# EAGLE design googleShoes_rev01 (EAGLE 6.2)
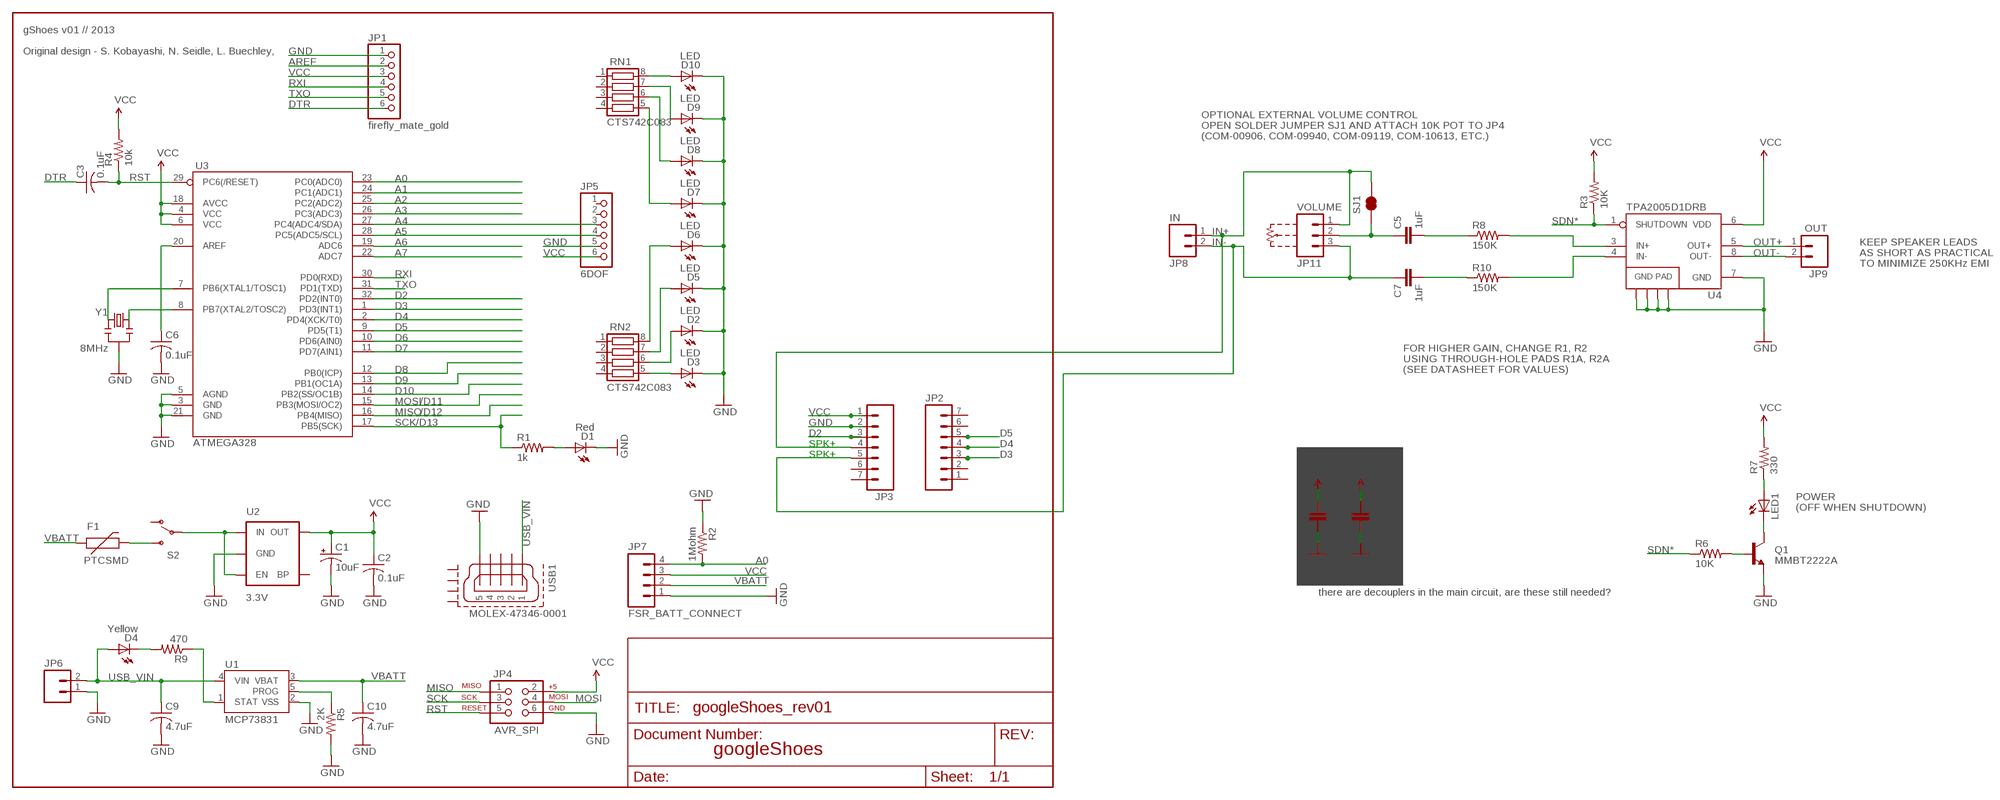
[diagram p0: schematic, sheet 1]

## Parts
C1  10uF  CAP_POL1206  [EIA3216]
C2  0.1uF  C-USC0805  [C0805]
C3  0.1uF  C-USC0805  [C0805]
C4  1uF  CAP1206  [1206]
C5  1uF  CAP1206  [1206]
C6  0.1uF  C-USC0805  [C0805]
C7  1uF  CAP1206  [1206]
C8  10uF  CAP1206  [1206]
C9  4.7uF  C-USC0805  [C0805]
C10  4.7uF  C-USC0805  [C0805]
D1  Red  LEDCHIP-LED0805  [CHIP-LED0805]
D2  LED  LEDCHIP-LED0805  [CHIP-LED0805]
D3  LED  LEDCHIP-LED0805  [CHIP-LED0805]
D4  Yellow  LEDCHIP-LED0805  [CHIP-LED0805]
D5  LED  LEDCHIP-LED0805  [CHIP-LED0805]
D6  LED  LEDCHIP-LED0805  [CHIP-LED0805]
D7  LED  LEDCHIP-LED0805  [CHIP-LED0805]
D8  LED  LEDCHIP-LED0805  [CHIP-LED0805]
D9  LED  LEDCHIP-LED0805  [CHIP-LED0805]
D10  LED  LEDCHIP-LED0805  [CHIP-LED0805]
F1  PTCSMD  [PTC-1206]
JP1  firefly_mate_gold  PINHD-1X6B  [1X06-BIG]
JP2  M07  [1X07]
JP3  M07  [1X07]
JP4  AVR_SPI  AVR_SPI_PRG_6PTH  [2X3]
JP5  6DOF  PINHD-1X6B  [1X06-BIG]
JP6  M02PTH  [1X02]
JP7  FSR_BATT_CONNECT  M04PTH  [1X04]
JP8  IN  M02PTH  [1X02]
JP9  OUT  M02PTH  [1X02]
JP11  VOLUME  M03PTH  [1X03]
LED1  LEDCHIPLED_0805  [CHIPLED_0805]
Q1  MMBT2222A  TRANSISTOR_NPNSOT23-3  [SOT23-3]
R1  1k  R-US_M0805  [M0805]
R2  1Mohm  R-US_M0805  [M0805]
R3  10K  R-US_M0805  [M0805]
R4  10k  R-US_M0805  [M0805]
R5  2K  R-US_M0805  [M0805]
R6  10K  R-US_M0805  [M0805]
R7  330  R-US_M0805  [M0805]
R8  150K  R-US_M0805  [M0805]
R9  470  R-US_M0805  [M0805]
R10  150K  R-US_M0805  [M0805]
RN1  CTS742C083  [CTS742C083]
RN2  CTS742C083  [CTS742C083]
S2  SWITCH-SPSTSMD  [AYZ0202]
SJ1  SOLDERJUMPERNC2  [SJ_2S-NOTRACE]
U1  MCP73831  MCP73831SMD  [SOT23-5]
U2  3.3V  V_REG_LDOSMD  [SOT23-5]
U3  ATMEGA328  ATMEGA168  [TQFP32-08]
U4  TPA2005D1DRB  [QFN-8_PAD]
USB1  MOLEX-47346-0001  [MOLEX-47364-0001]
Y1  8MHz  RESONATORSMD  [RESONATOR-SMD]

## Nets
A0: JP7.4 R2.2 U3.23(PC0(ADC0))
A1: U3.24(PC1(ADC1))
A2: U3.25(PC2(ADC2))
A3: U3.26(PC3(ADC3))
A4: JP5.3 U3.27(PC4(ADC4/SDA))
A5: JP5.4 U3.28(PC5(ADC5/SCL))
A6: U3.19(ADC6)
A7: U3.22(ADC7)
AREF: C6.1 JP1.2 U3.20(AREF)
D2: JP3.3 U3.32(PD2(INT0))
D3: JP2.3 U3.1(PD3(INT1))
D4: JP2.4 U3.2(PD4(XCK/T0))
D5: JP2.5 U3.9(PD5(T1))
D6: U3.10(PD6(AIN0))
D7: U3.11(PD7(AIN1))
D8: U3.12(PB0(ICP))
D9: U3.13(PB1(OC1A))
D10: U3.14(PB2(SS/OC1B))
DTR: C3.1 JP1.6
GND: C1.C(-) C2.2 C4.2 C6.2 C8.2 C9.2 C10.2 D1.C D2.C D3.C D5.C D6.C D7.C D8.C D9.C D10.C JP1.1 JP3.2 JP4.6 JP5.5 JP6.1 JP7.1 Q1.2(E) R2.1 R5.2 U1.2(VSS) U2.2(GND) U3.3(GND) U3.5(AGND) U3.21(GND) U4.7(GND) U4.10(GND) U4.11(GND) U4.12(GND) U4.13(GND) USB1.5 Y1.2
IN+: JP3.4 JP8.1 JP11.1 SJ1.2
IN+AMP: R8.2 U4.3(IN+)
IN-: C7.1 JP3.5 JP8.2 JP11.3
IN-AMP: R10.2 U4.4(IN-)
MISO: JP4.1 U3.16(PB4(MISO))
MOSI: JP4.4 U3.15(PB3(MOSI/OC2))
N$1: C5.1 JP11.2 SJ1.1
N$2: D1.A R1.2
N$3: D3.A RN2.5
N$4: D2.A RN2.6
N$5: S2.2(P) U2.1(IN) U2.3(EN)
N$6: D5.A RN2.7
N$7: D6.A RN2.8
N$8: D4.C R9.2
N$9: F1.2 S2.3(S)
N$10: U3.7(PB6(XTAL1/TOSC1)) Y1.3
N$11: R5.1 U1.5(PROG)
N$12: U3.8(PB7(XTAL2/TOSC2)) Y1.1
N$13: D10.A RN1.8
N$14: R9.1 U1.1(STAT)
N$15: D9.A RN1.7
N$16: D8.A RN1.6
N$17: D7.A RN1.5
N$18: LED1.A R7.1
N$19: Q1.1(B) R6.2
N$20: LED1.C Q1.3(C)
N$21: C5.2 R8.1
N$22: C7.2 R10.1
OUT+: JP9.1 U4.5(OUT+)
OUT-: JP9.2 U4.8(OUT-)
RST: C3.2 JP4.5 R4.1 U3.29(PC6(/RESET))
RXI: JP1.4 U3.30(PD0(RXD))
SCK: JP4.3 R1.1 U3.17(PB5(SCK))
SDN*: R3.1 R6.1 U4.1(SHUTDOWN)
TXO: JP1.5 U3.31(PD1(TXD))
USB_VIN: C9.1 D4.A JP6.2 U1.4(VIN) USB1.1
VBATT: C10.1 F1.1 JP7.2 U1.3(VBAT)
VCC [VCC]: C1.A(+) C2.1 C4.1 C8.1 JP1.3 JP3.1 JP4.2 JP5.6 JP7.3 R3.2 R4.2 R7.2 U2.5(OUT) U3.4(VCC) U3.6(VCC) U3.18(AVCC) U4.6(VDD)
Unconnected: JP2.1 JP2.2 JP2.6 JP2.7 JP3.6 JP3.7 JP5.1 JP5.2 RN1.1 RN1.2 RN1.3 RN1.4 RN2.1 RN2.2 RN2.3 RN2.4 S2.1(O) U2.4(BP) USB1.2 USB1.3 USB1.4 USB1.GND1 USB1.GND2 USB1.GND3 USB1.GND4

## Notes on the sheet
- gShoes v01 // 2013
- Original design - S. Kobayashi, N. Seidle, L. Buechley,
- OPTIONAL EXTERNAL VOLUME CONTROL
- OPEN SOLDER JUMPER SJ1 AND ATTACH 10K POT TO JP4
- (COM-00906, COM-09940, COM-09119, COM-10613, ETC.)
- KEEP SPEAKER LEADS
- AS SHORT AS PRACTICAL
- TO MINIMIZE 250KHz EMI
- FOR HIGHER GAIN, CHANGE R1, R2
- USING THROUGH-HOLE PADS R1A, R2A
- (SEE DATASHEET FOR VALUES)
- /D11
- /D12
- /D13
- SPK+
- SPK+
- POWER
- (OFF WHEN SHUTDOWN)
- there are decouplers in the main circuit, are these still needed?
- googleShoes

## Library data of the parts
C1 = SparkFun:CAP_POL: Capacitor Polarized These are standard SMD and PTH capacitors. Normally 10uF, 47uF, and 100uF in electrolytic and tantalum varieties. Always verify the external diameter of the through hole cap, it varies with capacity, voltage, and manufacturer. The EIA devices should be standard.
C2 C3 C6 C9 C10 = adafruit:C-US: CAPACITOR, American symbol
C4 C5 C7 C8 = SparkFun:CAP: Capacitor Standard 0603 ceramic capacitor, and 0.1" leaded capacitor.
D1-D10 = adafruit:LED: LED
F1 = SparkFun:PTC: Resettable Fuse PTC Resettable Fuse. Spark Fun Electronics SKU : COM-08357
JP1 JP5 = adafruit:PINHD-1X6: PIN HEADER
JP2 JP3 = SparkFun-Connectors:M07: Header 7 Standard 7-pin 0.1" header. Use with straight break away headers (SKU : PRT-00116), right angle break away headers (PRT-00553), swiss pins (PRT-00743), machine pins (PRT-00117), and female headers (PRT-00115). NOTES ON THE VARIANTS LOCK and LOCK_LONGPADS... This footprint was designed to help hold the alignment of a through-hole component (i.e. 7-pin header) while soldering it into place. You may notice that each hole has been shifted either up or down by 0.005 of an inch from it's more standard position (which is usually a perfectly straight line). This slight alteration caused the pins (the squares in the middle) to touch the edges of the holes. Because they are alternating, it causes a "brace" to hold the header in place. 0.005 has proven to be the perfect amount of "off-center" position when using our standard breakaway headers. Although looks a little odd when you look at the bare footprint, once you have a header in there, the alteration is very hard to notice. Also, if you push a header all the way into place, it is covered up entirely on the bottom side. This idea of altering the position of holes to aid alignment will be further integrated into the Sparkfun Library for other footprints. It can help hold any component with 3 or more connection pins.
JP4 = SparkFun:AVR_SPI_PRG_6: AVR ISP 6 Pin This is the reduced ISP connector for AVR programming. Common on Arduino. This footprint will take up less PCB space and can be used with a 10-pin to 6-pin adapter such as SKU: BOB-08508
JP6 JP8 JP9 = SparkFun:M02: Header 2 Standard 2-pin 0.1" header. Use with straight break away headers (SKU : PRT-00116), right angle break away headers (PRT-00553), swiss pins (PRT-00743), machine pins (PRT-00117), and female headers (PRT-00115). Molex polarized connector foot print use with SKU : PRT-08233 with associated crimp pins and housings.
JP7 = SparkFun-Connectors:M04: Header 4 Standard 4-pin 0.1" header. Use with straight break away headers (SKU : PRT-00116), right angle break away headers (PRT-00553), swiss pins (PRT-00743), machine pins (PRT-00117), and female headers (PRT-00115). Molex polarized connector foot print use with SKU : PRT-08231 with associated crimp pins and housings. 1MM SMD Version SKU: PRT-10208
JP11 = SparkFun:M03: Header 3 Standard 3-pin 0.1" header. Use with straight break away headers (SKU : PRT-00116), right angle break away headers (PRT-00553), swiss pins (PRT-00743), machine pins (PRT-00117), and female headers (PRT-00115). Molex polarized connector foot print use with SKU : PRT-08232 with associated crimp pins and housings.
LED1 = led:LED: LED
Q1 = SparkFun:TRANSISTOR_NPN: Transistor NPN BJT configuration in SOT23 package. MMBT2222 is the common NPN we use. Double check BCE configuration again layout.
R1 R2 R4 R5 R9 = rcl:R-US_: RESISTOR, American symbol
R3 R6-R8 R10 = resistor:R-US_: RESISTOR, American symbol
RN1 RN2 = resistor-net:CTS742C083: Chip Resistor Array 4 Single Resistor Source: http://www.ctscorp.com/components/Datasheets/CTSChipArrayDs.pdf; OC_FARNELL: unknown; OC_NEWARK: unknown
S2 = SparkFun:SWITCH-SPST: SPST Switch Simple slide switch. Spark Fun Electronics SKU : COM-00102
SJ1 = SparkFun:SOLDERJUMPER: Solder Jumper Standard SMD solder jumper. Used to automate production. Two varients : Normally Open and Normally Closed are the same, but have different paste layers. NC will have a large amount of paste and should jumper during reflow.
U1 = SparkFun:MCP73831
U2 = SparkFun:V_REG_LDO: Voltage Regulator LDO Standard 150mA LDO voltage regulator in SOT-23 layout. Micrel part MIC5205. BP (by-pass) pin is used to lower output noise with 470pF cap.
U3 = SparkFun:ATMEGA168
U4 = mike-temp:TPA2005D1: 1.4W MONO CLASS-D AUDIO POWER AMPLIFIER The TPA2005D1 is a 1.4-W high efficiency filter-free class-D audio power amplifier in a BGA, QFN, or MSOP package that requires only three external components. Datasheet: http://focus.ti.com/lit/ds/symlink/tpa2005d1.pdf 1.4 W Into 8 ? From a 5V Supply at THD = 10% (Typ) Maximum Battery Life and Minimum Heat Efficiency With an 8-? Speaker: 84% at 400 mW, 79% at 100 mW 2.8-mA Quiescent Current 0.5-mA Shutdown Current Ideal for Wireless or Cellular Handsets and PDAs Capable of Driving an 8-? Speaker (2.5 V ? VDD ? 5.5 V) and a 4-? Speaker (2.5 V ? VDD ? 4.2 V) Only Three External Components Optimized PWM Output Stage Eliminates LC Output Filter Internally Generated 250-kHz Switching Frequency Eliminates Capacitor and Resistor Improved PSRR (-71 dB at 217 Hz) and Wide Supply Voltage (2.5 V to 5.5 V) Eliminates Need for a Voltage Regulator Fully Differential Design Reduces RF Rectification and Eliminates Bypass Capacitor Improved CMRR Eliminates Two Input Coupling Capacitors
USB1 = usb_con-update:MOLEX-47346-0001: MICRO USB B, BOTTOM MOUNT
Y1 = SparkFun:RESONATOR: Resonator Small SMD resonator. This is the itty bitty 10/20MHz resonators with built in caps. CSTCE10M0G55 and CSTCE20M0V53. Footprint has been reviewed closely but hasn't been tested yet.

## Net classes
0 Default: width 0.203 mm
1 VCC: width 0.381 mm
2 LEDPower: width 0.203 mm
3 ButtonSignal: width 0.203 mm

## Board
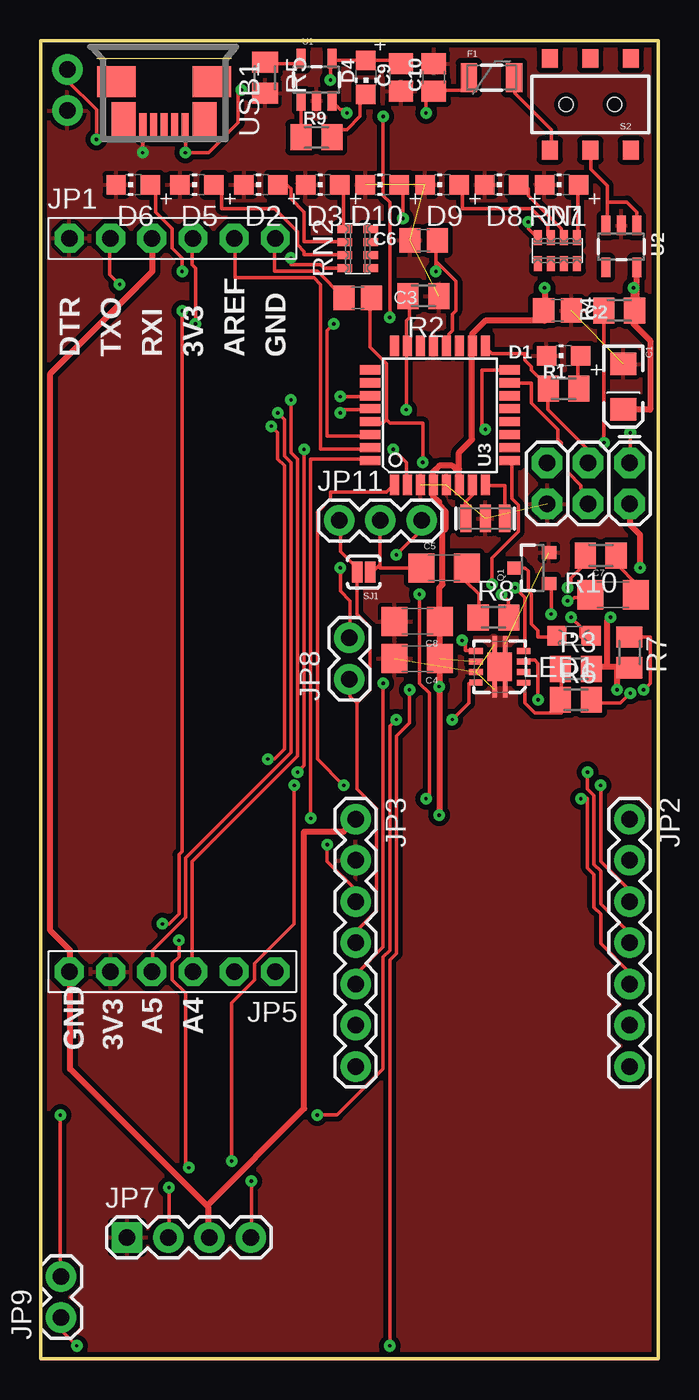
[diagram p1: board, top side]
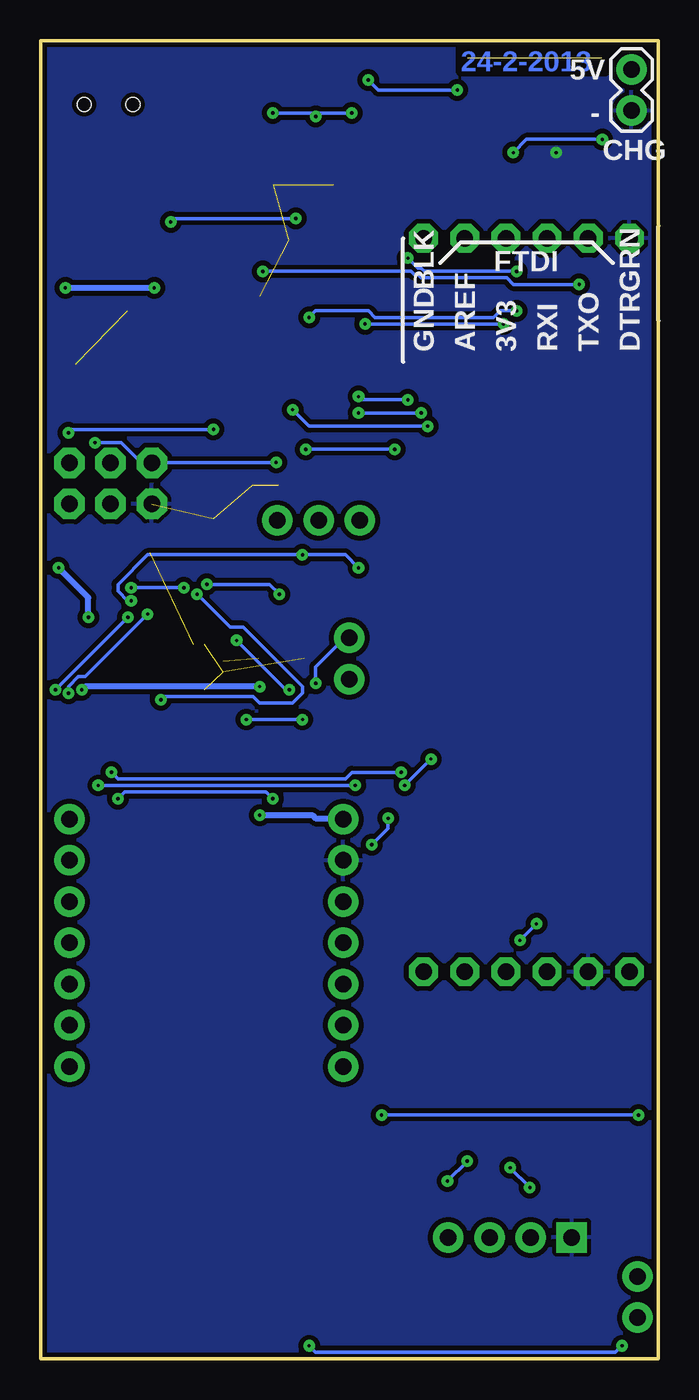
[diagram p2: board, bottom side, seen from below]

Size 38.1 x 81.28 mm. Coordinates in mm from the lower left corner, seen from the top.
Outline: 38.1,0 0,0 0,81.28 38.1,81.28 38.1,0
Copper layers (1*16): Top 0.035mm / dielectric 1.5mm / Bottom 0.035mm
Design rules: minimum track width 8mil, minimum drill 8mil, track to track 8mil, track to pad 8mil, pad to pad 8mil, via to via 4mil, smd to smd 8mil, copper to edge 8mil, drill to drill 8mil, minimum pad ring 12mil, minimum via ring 10mil, stop-mask expansion 4mil, vias tented up to drill 20mil, thermal gap 10mil

### Footprints (pad centres in the part's own frame; a part is rotated, then mirrored left to right if it is on the bottom)
EIA3216 = smd 1.4 x 1.6: A 1.4,0; C -1.4,0
C0805 = smd 1.3 x 1.5: 1 -0.85,0; 2 0.85,0
1206 = smd 1.6 x 1.8: 1 -1.4,0; 2 1.4,0
CHIP-LED0805 = smd 1.2 x 1.2: A 0,-1.05; C 0,1.05
PTC-1206 = smd 1 x 1.8: 1 -1.4,0; 2 1.4,0
1X06-BIG = drill 1.016 pad 1.778 octagon: 1 -6.35,0; 2 -3.81,0; 3 -1.27,0; 4 1.27,0; 5 3.81,0; 6 6.35,0
1X07 = drill 1.016 pad 1.88: 1 0,0; 2 2.54,0; 3 5.08,0; 4 7.62,0; 5 10.16,0; 6 12.7,0; 7 15.24,0
2X3 = drill 1.016 pad 1.88 octagon: 1 0,0; 2 0,2.54; 3 2.54,0; 4 2.54,2.54; 5 5.08,0; 6 5.08,2.54
1X02 = drill 1.016 pad 1.88: 1 0,0; 2 2.54,0
1X04 = drill 1.016 pad 1.88 square: 1 0,0 | drill 1.016 pad 1.88: 2 2.54,0; 3 5.08,0; 4 7.62,0
1X03 = drill 1.016 pad 1.88: 1 0,0; 2 2.54,0; 3 5.08,0
CHIPLED_0805 = smd 1.2 x 1.2: A 0,-1.05; C 0,1.05
SOT23-3 = smd 0.8 x 0.9: 1 -0.95,-1; 2 0.95,-1; 3 0,1.1
M0805 = smd 1.3 x 1.6: 1 -0.95,0; 2 0.95,0
CTS742C083 = smd 0.5 x 0.9: 1 -1.2,-0.8; 2 -0.4,-0.8; 3 0.4,-0.8; 4 1.2,-0.8; 5 1.2,0.8; 6 0.4,0.8; 7 -0.4,0.8; 8 -1.2,0.8
AYZ0202 = smd 1 x 1.15: 1 -2.5,2.825; 2 0,2.825; 3 2.5,2.825; 4 -2.5,-2.825; 5 0,-2.825; 6 2.5,-2.825 | hole 0.85: 1.5,0; -1.5,0
SJ_2S-NOTRACE = smd 0.635 x 1.27: 1 -0.401,0; 2 0.413,0
SOT23-5 = smd 0.55 x 1.2: 1 -0.95,-1.3; 2 0,-1.3; 3 0.95,-1.3; 4 0.95,1.3; 5 -0.95,1.3
TQFP32-08 = smd 1.27 x 0.559: 1 -4.293,2.8; 2 -4.293,2; 3 -4.293,1.2; 4 -4.293,0.4; 5 -4.293,-0.4; 6 -4.293,-1.2; 7 -4.293,-2; 8 -4.293,-2.8; 17 4.293,-2.8; 18 4.293,-2; 19 4.293,-1.2; 20 4.293,-0.4; 21 4.293,0.4; 22 4.293,1.2; 23 4.293,2; 24 4.293,2.8 | smd 0.559 x 1.27: 9 -2.8,-4.293; 10 -2,-4.293; 11 -1.2,-4.293; 12 -0.4,-4.293; 13 0.4,-4.293; 14 1.2,-4.293; 15 2,-4.293; 16 2.8,-4.293; 25 2.8,4.293; 26 2,4.293; 27 1.2,4.293; 28 0.4,4.293; 29 -0.4,4.293; 30 -1.2,4.293; 31 -2,4.293; 32 -2.8,4.293
QFN-8_PAD = smd 0.35 x 0.85: 1 -0.975,-1.475; 2 -0.325,-1.475; 3 0.325,-1.475; 4 0.975,-1.475; 5 0.975,1.475; 6 0.325,1.475; 7 -0.325,1.475; 8 -0.975,1.475 | smd 1.75 x 1.5: 9 0,0 | smd 1.025 x 0.28: 10 -1.387,-0.325; 11 1.387,-0.325; 12 1.387,0.325; 13 -1.387,0.325
MOLEX-47364-0001 = smd 1.7 x 0.45: 1 2.8,1.3; 2 2.8,0.65; 3 2.8,0; 4 2.8,-0.65; 5 2.8,-1.3 | smd 1.9 x 2.375: GND1 0,2.95; GND4 0,-2.95 | smd 2.1 x 1.475: GND2 2.3,2.5; GND3 2.3,-2.5
RESONATOR-SMD = smd 0.7 x 1.7: 1 -1.2,0; 2 0,0; 3 1.2,0

### Placement (x,y rotation side)
C1  35.94,59.94 270 top
C2  31.88,64.64 0 top
C3  19.56,65.41 0 top
C4  23.24,43.18 180 top
C5  24.89,48.77 0 top
C6  23.62,68.96 180 top
C7  35.31,47.12 0 top
C8  23.24,45.47 180 top
C9  22.23,78.99 270 top
C10  24.26,78.99 90 top
D1  32.26,61.85 90 top
D2  13.59,72.39 90 top
D3  17.4,72.39 90 top
D4  20.07,78.99 180 top
D5  9.65,72.39 90 top
D6  5.71,72.39 90 top
D7  32.13,72.39 90 top
D8  28.45,72.39 90 top
D9  24.77,72.39 90 top
D10  21.08,72.39 90 top
F1  27.81,78.99 0 top
JP1  8.13,69.09 0 top
JP2  36.32,33.27 270 top
JP3  19.43,33.27 270 top
JP4  36.32,55.24 180 top
JP5  8.13,23.88 180 top
JP6  1.65,76.96 90 bottom
JP7  5.33,7.49 0 top
JP8  19.05,41.91 90 top
JP9  1.27,2.54 90 top
JP11  18.41,51.69 0 top
LED1  32.89,44.58 90 top
Q1  30.35,48.77 90 top
R1  32.26,59.82 0 top
R2  23.62,65.53 180 top
R3  33.02,42.55 0 top
R4  35.69,64.64 0 top
R5  13.84,78.99 270 top
R6  33.02,40.64 0 top
R7  36.32,43.56 270 top
R8  27.94,45.72 0 top
R9  17.02,75.31 0 top
R10  34.54,49.53 180 top
RN1  31.88,68.33 0 top
RN2  19.56,68.45 90 top
S2  33.91,77.34 180 top
SJ1  19.94,48.51 180 top
U1  17.02,78.87 0 top
U2  35.81,68.58 180 top
U3  24.63,58.18 90 top
U4  28.32,42.67 90 top
USB1  7.62,78.74 270 top
Y1  27.43,51.82 180 top

### Tracks (layer width: path | path; a pad name or v marks a point on that pad's centre or on a via)
A0  (via drill 0.2)
  Top 0.203: R2.2 22.76,65.43 22.76,64.21 22.55,64.01 22.55,62.59 U3.23 22.55,62.38 v22.55,58.52 | v14.22,57.51 14.63,57.1 14.63,55.47 15.04,55.07 15.04,37.59 14.43,36.98 v14.02,36.98 | v15.65,35.36 15.65,26.82 13.21,24.38 13.21,23.37 11.79,21.95 v11.79,12.19 | v13.01,10.97 13.01,7.52 JP7.4
  Bottom 0.203: v22.55,58.52 21.54,57.51 v14.22,57.51 | v15.65,35.36 v14.02,36.98 | v13.01,10.97 v11.79,12.19
A4  (via drill 0.2)
  Top 0.203: v18.49,59.33 20.32,59.33 U3.27 | v15.44,59.13 15.44,55.88 15.85,55.47 15.85,37.19 9.35,30.68 9.35,23.98 JP5.3
  Bottom 0.203: v18.49,59.33 18.29,59.13 v15.44,59.13
A5  (via drill 0.2)
  Top 0.203: v18.49,58.32 18.49,58.52 20.32,58.52 U3.28 | v14.63,58.32 15.04,57.91 15.04,55.68 15.44,55.27 15.44,37.39 8.94,30.89 8.94,27.23 6.91,25.2 6.91,23.98 JP5.4
  Bottom 0.203: v14.63,58.32 v18.49,58.32
AREF  (via drill 0.2)
  Top 0.203: 24.38,67.67 25.6,66.45 25.6,64.62 25.4,64.41 25.4,63.4 25.2,63.2 25.2,62.59 U3.20 | 24.38,67.67 24.38,68.89 C6.1 | v4.88,66.24 4.27,66.85 4.27,69.09 JP1.2 | 24.38,67.67 v24.38,67.06
  Bottom 0.203: v4.88,66.24 8.94,66.24 9.35,66.65 14.63,66.65 14.83,66.85 15.04,66.85 15.24,67.06 v24.38,67.06
D2  (via drill 0.2)
  Top 0.203: v16.66,33.33 16.66,55.47 20.32,55.47 U3.32 | v17.68,31.7 17.68,30.68 19.51,28.85 19.51,28.25 JP3.3
  Bottom 0.203: v16.66,33.33 16.66,32.72 v17.68,31.7
D3  (via drill 0.2)
  Top 0.203: v18.69,35.36 17.07,36.98 17.07,52.22 17.88,53.03 17.88,53.44 21.34,53.44 21.74,53.85 U3.1 | v34.54,35.36 34.54,30.68 36.37,28.85 36.37,28.25 JP2.3
  Bottom 0.203: v34.54,35.36 v18.69,35.36
D4  (via drill 0.2)
  Top 0.203: v21.74,56.08 22.55,55.27 22.55,54.05 U3.2 | v16.26,56.08 16.26,36.58 v15.85,36.17 | v33.73,36.17 33.73,35.15 34.14,34.75 34.14,30.48 34.54,30.07 34.54,28.04 36.37,26.21 36.37,25.81 JP2.4
  Bottom 0.203: v16.26,56.08 v21.74,56.08 | v15.85,36.17 18.9,36.17 19.3,35.76 33.33,35.76 v33.73,36.17
D5  (via drill 0.2)
  Top 0.203: v27.84,47.75 27.84,49.38 29.46,51 29.46,52.63 29.06,53.03 29.06,55.27 U3.9 | v23.37,47.14 23.37,41.66 23.98,41.05 23.98,34.75 v23.77,34.54 | v33.33,34.54 33.73,34.54 33.73,30.28 34.14,29.87 34.14,27.84 34.54,27.43 34.54,25.6 36.37,23.77 36.37,23.16 JP2.5
  Bottom 0.203: v27.84,47.75 23.98,47.75 v23.37,47.14 | v23.77,34.54 24.18,34.95 32.92,34.95 v33.33,34.54
DTR
  Top 0.203: C3.1 18.69,65.43 17.07,67.06 14.43,67.06 14.43,69.09 JP1.6
GND  (via drill 0.2)  (11 unrouted)
  Top 0.203: v6.3,74.37 6.3,75.79 USB1.5
  pour Top (isolate 0.305): 0,81.28 38.1,81.28 38.1,0 0,0
  pour Bottom (isolate 0.305): 0,81.28 38.1,81.28 38.1,0 0,0
IN+
  Top 0.203: 19.51,40.44 20.32,41.25 20.32,45.11 19.51,45.92 19.51,48.36 SJ1.2 19.51,48.56 19.51,48.77 18.49,49.78 18.49,51.61 JP11.1 | 19.51,40.44 19.51,35.15 20.73,33.93 20.73,27.64 19.51,26.42 19.51,25.81 JP3.4 | 19.51,40.44 19.1,40.84 19.1,41.86 JP8.1
IN+AMP  (via drill 0.2)
  Top 0.203: v28.45,47.14 28.85,46.74 28.85,45.72 R8.2 | v30.68,40.64 30.68,42.88 30.48,43.08 29.87,43.08 U4.3
  Bottom 0.203: v28.45,47.14 26.42,45.11 25.6,45.11 21.95,41.45 21.95,41.05 22.55,40.44 24.59,40.44 24.99,40.84 30.48,40.84 v30.68,40.64
IN-  (via drill 0.2)
  Top 0.203: v18.49,48.77 18.49,47.35 19.1,46.74 19.1,44.5 JP8.2 | v21.95,49.58 23.57,51.21 23.57,51.61 JP11.3 | v32.51,46.74 32.72,46.74 32.92,46.94 33.73,46.94 C7.1 | v21.13,41.66 21.13,25.4 19.51,23.77 19.51,23.16 JP3.5
  Bottom 0.203: v18.49,48.77 19.3,49.58 v21.95,49.58 31.5,49.58 33.33,47.75 33.33,47.35 32.72,46.74 v32.51,46.74 | v21.13,41.66 21.13,42.67 19.3,44.5 19.1,44.5 JP8.2
IN-AMP  (via drill 0.2)
  Top 0.203: v29.26,47.55 29.87,46.94 29.87,43.69 U4.4 | v32.51,47.55 32.72,47.75 32.72,48.16 33.53,48.97 33.53,49.38 R10.2
  Bottom 0.203: v32.51,47.55 v29.26,47.55
MISO  (via drill 0.2)
  Top 0.203: v27.43,57.3 27.23,57.51 27.23,60.96 28.85,60.96 U3.16 | v36.37,57.1 36.37,55.27 JP4.1
  Bottom 0.203: v27.43,57.3 36.17,57.3 v36.37,57.1
MOSI
  Top 0.203: U3.15 29.06,60.15 30.28,60.15 30.28,58.93 31.9,57.3 31.9,56.69 32.11,56.49 32.11,56.29 32.51,55.88 32.51,54.66 33.33,53.85 33.33,53.65 33.73,53.24 33.73,52.83 JP4.4
N$1
  Top 0.203: 20.93,48.97 20.52,48.56 SJ1.1 | 20.93,48.97 20.93,51.61 JP11.2 | C5.1 20.93,48.77 20.93,48.97
N$2
  Top 0.203: D1.A 33.12,61.77 33.12,59.94 R1.2
N$3
  Top 0.203: RN2.5 18.69,69.7 18.69,72.34 18.49,72.54 D3.A
N$4
  Top 0.203: RN2.6 18.69,68.89 16.26,68.89 16.26,70.71 15.44,71.53 15.44,72.14 15.24,72.34 14.83,72.34 D2.A
N$5
  Top 0.203: 34.95,71.32 34.95,69.9 U2.3 | 34.95,71.32 34.95,72.34 33.93,73.36 33.93,74.37 S2.2 | 34.95,71.32 36.17,71.32 36.78,70.71 36.78,69.9 U2.1
N$6
  Top 0.203: RN2.7 18.69,68.07 16.26,68.07 16.26,68.28 15.85,68.68 15.85,69.49 14.43,70.92 11.18,70.92 11.18,72.34 10.77,72.34 D5.A
N$7  (via drill 0.2)
  Top 0.203: v15.44,67.87 15.44,67.46 17.27,67.46 17.48,67.26 18.69,67.26 RN2.8 | v8.74,67.06 8.74,67.87 8.13,68.48 8.13,69.7 7.11,70.71 7.11,72.34 6.91,72.54 D6.A
  Bottom 0.203: v15.44,67.87 14.83,67.26 14.63,67.26 14.43,67.06 v8.74,67.06
N$8
  Top 0.203: D4.C 19.91,78.03 19.71,78.03 19.71,76.61 18.9,75.79 17.88,75.79 17.88,75.39 R9.2
N$9
  Top 0.203: S2.3 31.5,74.57 31.5,75.79 29.26,78.03 29.26,78.84 F1.2
N$10
  Top 0.203: U3.7 26.62,53.85 26.62,53.24 26.21,52.83 26.21,51.82 Y1.3
N$11
  Top 0.203: U1.5 16.05,80.06 15.85,79.86 14.02,79.86 R5.1
N$12
  Top 0.203: U3.8 27.43,53.85 28.65,53.85 28.65,51.82 Y1.1
N$13  (via drill 0.2)
  Top 0.203: v30.07,70.1 30.07,69.7 30.48,69.29 RN1.8 | v22.35,70.31 22.35,72.34 22.15,72.54 D10.A
  Bottom 0.203: v30.07,70.1 29.87,70.31 v22.35,70.31
N$14
  Top 0.203: U1.1 16.05,77.42 16.05,75.39 R9.1
N$15
  Top 0.203: RN1.7 31.29,69.29 31.29,69.9 30.28,70.92 26.01,70.92 26.01,72.34 D9.A
N$16
  Top 0.203: RN1.6 32.11,69.29 32.11,69.7 30.07,71.73 30.07,72.14 29.67,72.54 D8.A
N$17
  Top 0.203: D7.A 33.12,72.34 33.12,69.29 RN1.5
N$18  (via drill 0.2)
  Top 0.203: v32.72,45.72 33.33,45.11 33.33,44.5 33.93,44.5 LED1.A | v37.19,41.25 37.59,41.66 37.59,44.5 36.37,44.5 R7.1
  Bottom 0.203: v37.19,41.25 v32.72,45.72
N$19  (via drill 0.2)
  Top 0.203: v31.5,45.92 31.5,47.75 Q1.1 | v36.37,41.05 35.76,40.44 33.93,40.44 33.93,40.64 R6.2
  Bottom 0.203: v31.5,45.92 35.36,42.06 35.76,42.06 36.37,41.45 v36.37,41.05
N$20
  Top 0.203: Q1.3 29.87,48.77 30.07,48.56 30.07,47.35 30.28,47.14 30.28,45.31 30.68,44.91 30.68,44.5 31.7,44.5 LED1.C
N$21
  Top 0.203: R8.1 27.03,45.72 27.03,47.14 26.21,47.95 26.21,48.77 C5.2
N$22
  Top 0.203: R10.1 35.56,49.38 35.56,48.97 36.78,47.75 36.78,47.14 C7.2
OUT+  (via drill 0.2)
  Top 0.203: v26.01,44.3 26.21,44.09 26.21,43.69 26.82,43.69 U4.5 | v22.76,41.25 22.76,39.22 21.95,38.41 21.95,24.99 21.54,24.59 v21.54,0.81 | v2.23,0.81 1.22,1.83 1.22,2.44 JP9.1
  Bottom 0.203: v26.01,44.3 22.96,41.25 v22.76,41.25 | v21.54,0.81 21.13,0.41 2.64,0.41 v2.23,0.81
OUT-  (via drill 0.2)
  Top 0.203: v25.4,39.42 26.42,40.44 26.42,41.66 26.82,41.66 U4.8 | v21.95,39.42 21.54,39.01 21.54,25.2 21.13,24.79 21.13,17.88 18.29,15.04 v17.07,15.04 | v1.22,15.04 1.22,5.08 JP9.2
  Bottom 0.203: v21.95,39.42 v25.4,39.42 | v1.22,15.04 v17.07,15.04
RST  (via drill 0.2)
  Top 0.203: 21.34,57.91 21.34,61.37 20.32,62.38 20.32,65.23 C3.2 | 21.34,57.91 21.13,57.71 20.52,57.71 U3.29 | v34.75,56.49 34.75,64.62 R4.1 | 21.34,57.91 21.54,57.71 23.57,57.71 v23.57,55.27
  Bottom 0.203: v34.75,56.49 33.12,56.49 31.9,55.27 31.29,55.27 JP4.5 31.09,55.27 v23.57,55.27
RXI  (via drill 0.2)
  Top 0.203: v18.09,63.8 17.68,63.4 17.68,56.9 20.32,56.9 U3.30 | v9.55,63.8 9.55,67.26 9.35,67.46 9.35,69.09 JP1.4
  Bottom 0.203: v9.55,63.8 v18.09,63.8
SCK
  Top 0.203: U3.17 27.43,62.38 27.84,61.98 29.87,61.98 29.87,61.57 30.28,61.16 30.28,60.96 31.09,60.15 31.29,60.15 31.29,59.94 R1.1 31.29,59.74 31.29,58.52 33.73,56.08 33.73,55.27 JP4.3
SDN*
  Top 0.203: 32.11,40.64 32.11,42.47 R3.1 | 32.11,40.64 32.11,39.83 30.48,39.83 29.87,40.44 29.87,41.66 U4.1 | 32.11,40.64 R6.1
TXO
  Top 0.203: U3.31 20.32,56.08 17.27,56.08 17.27,66.24 16.87,66.65 11.99,66.65 11.99,69.09 JP1.5
USB_VIN  (via drill 0.2)
  Top 0.203: C9.1 22.15,79.86 21.74,79.86 21.54,80.06 20.12,80.06 D4.A 19.91,80.06 18.09,80.06 U1.4 17.88,80.06 v17.88,78.84 | v3.45,75.18 3.45,77.01 1.63,78.84 1.63,79.45 JP6.2 | USB1.1 8.94,75.79 v8.94,74.37 10.36,74.37 12.19,76.2 12.19,78.03 v12.39,78.23
  Bottom 0.203: v8.94,74.37 8.13,75.18 v3.45,75.18 | v17.88,78.84 17.27,78.23 v12.39,78.23
VBATT  (via drill 0.2)
  Top 0.203: v18.9,76.81 18.69,77.01 18.49,77.01 18.09,77.42 U1.3 | v23.77,76.81 23.77,78.03 23.98,78.23 24.18,78.23 C10.1 24.38,78.23 26.01,78.23 26.21,78.44 26.21,78.84 F1.1 | v7.92,10.57 7.92,7.52 JP7.2 | v9.14,11.79 8.94,11.99 8.94,22.55 8.13,23.37 8.13,24.38 8.53,24.79 v8.53,25.81 | v7.52,26.82 7.92,26.82 8.53,27.43 8.53,31.09 8.74,31.29 v8.74,64.62 | v21.54,64.21 21.54,71.32 21.13,71.73 v21.13,76.61
  Bottom 0.203: v23.77,76.81 21.13,76.81 | 21.13,76.81 v18.9,76.81 | v9.14,11.79 v7.92,10.57 | v7.52,26.82 v8.53,25.81 | v8.74,64.62 9.75,64.62 10.16,64.21 17.48,64.21 17.88,64.62 21.13,64.62 v21.54,64.21 | 21.13,76.81 v21.13,76.61
VCC  (via drill 0.2)  (1 unrouted)
  Top 0.381: 25.7,54.76 25.81,54.66 25.81,54.05 U3.6 | 25.7,54.76 25.4,55.07 24.59,55.07 24.18,54.66 24.18,54.05 U3.4 24.18,53.85 24.18,53.24 24.59,52.83 24.59,52.63 24.99,52.22 24.99,51.21 24.79,51 24.79,47.75 24.59,47.55 24.59,45.52 C8.1 24.59,45.31 24.59,43.28 C4.1 24.59,43.08 v24.59,41.45 v24.59,33.53 | 25.7,54.76 25.81,54.86 25.81,55.88 26.62,56.69 26.62,62.38 U3.18 26.62,62.59 26.62,63.2 27.43,64.01 31.09,64.01 31.09,64.62 C2.1 31.09,64.82 v31.09,66.04 | U2.5 36.78,67.26 36.78,65.43 36.58,65.23 36.58,64.82 R4.2 | v36.58,66.04 36.58,65.43 R4.2 | C1.A 35.97,58.52 37.59,58.52 37.59,62.79 36.58,63.8 36.58,64.62 R4.2 | 35.56,42.67 36.17,42.67 R7.2 35.56,42.67 | 35.56,42.67 34.95,42.67 | 34.95,42.67 34.14,42.67 R3.2 | v35.56,41.25 35.56,42.67 | v36.98,48.77 36.98,50.8 36.37,51.41 36.37,52.63 JP4.2 | v35.15,45.72 34.95,45.52 34.95,42.67 | 10.26,9.45 10.36,9.35 10.36,7.52 JP7.3 | 10.26,9.45 1.83,17.88 1.83,23.77 JP5.6 1.83,23.98 1.83,25.2 0.61,26.42 0.61,60.76 6.91,67.06 6.91,69.09 JP1.3 | 10.26,9.45 16.26,15.44 16.26,32.51 18.69,32.51 19.3,33.12 JP3.1
  Bottom 0.381: v36.58,66.04 v31.09,66.04 | v35.56,41.25 35.36,41.45 v24.59,41.45 | v24.59,33.53 21.34,33.53 21.13,33.33 19.51,33.33 JP3.1 | v36.98,48.77 35.15,46.94 v35.15,45.72

### Text on the board
Bottom: 24-2-2013
tPlace: googleShoes | v01 | D2 | D3* | A0 | DTR | TXO | RXI | 3V3 | AREF | GND | ON | CHG | A5 | A4 | GND | 3V3
bPlace: 5V | BAT | - | CHG | FTDI | GRN | BLK | DTR | TXO | RXI | 3V3 | AREF | GND | - | +
_bsilk: 6DOF